# Altium project DriverV2.0.PrjPcb
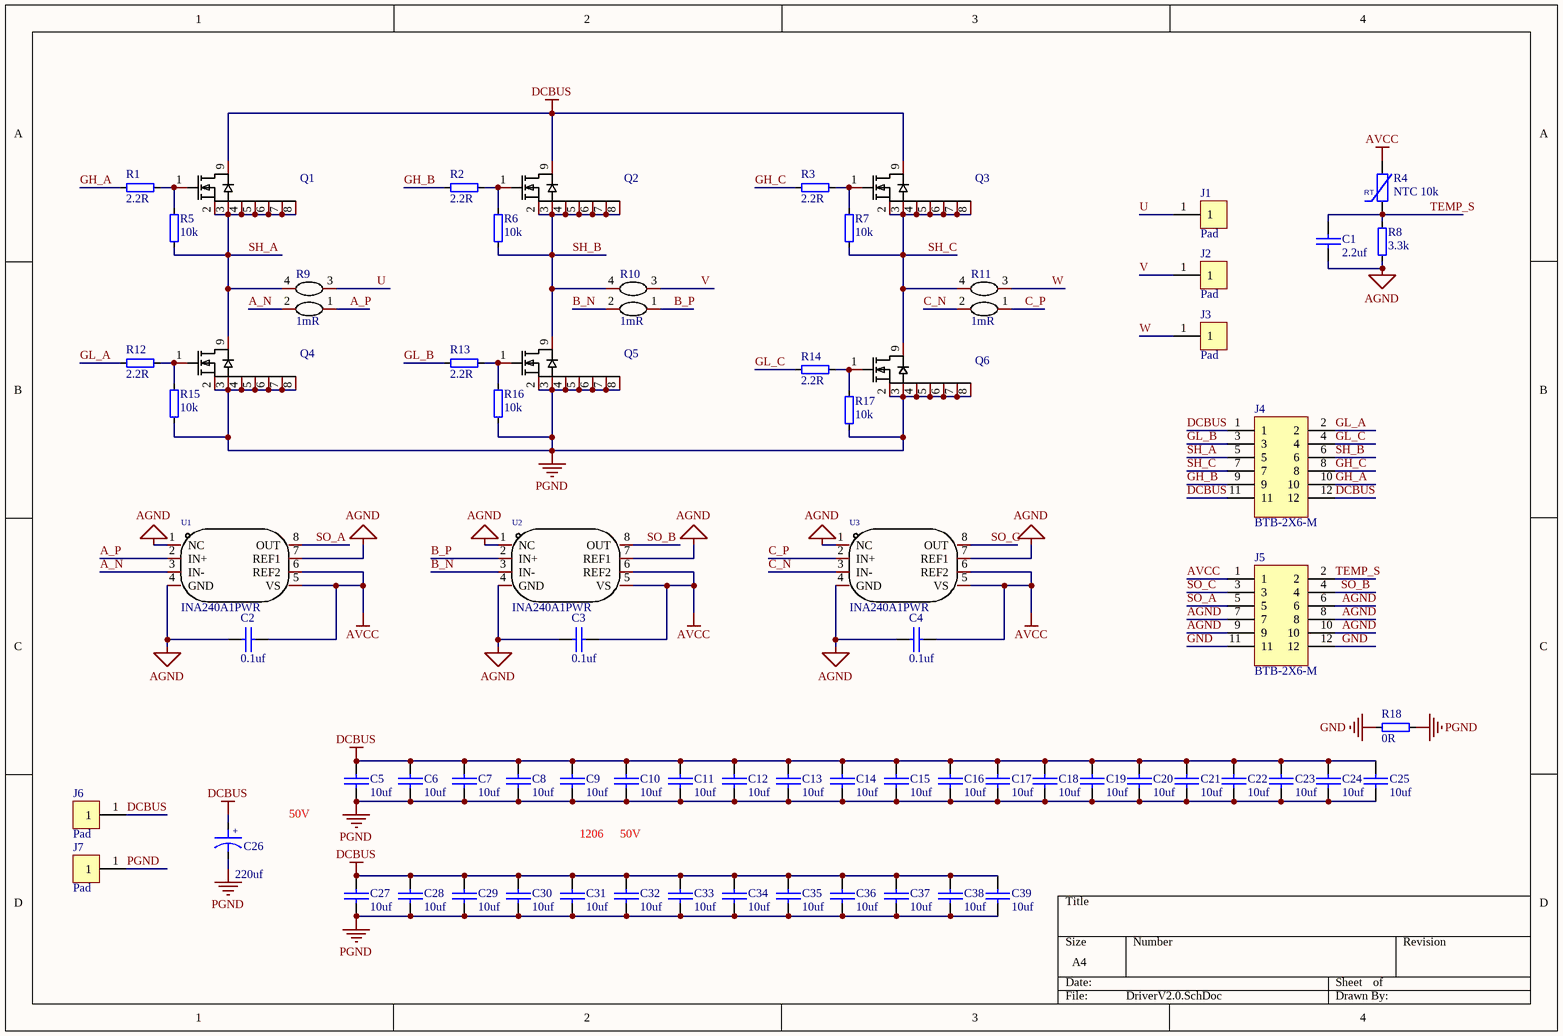
[diagram p0: DriverV2.0.SchDoc]
1 sheet, 73 parts. Net scope: global (net labels, ports and power ports of the same name join across sheets).
Board file: DriverV2.0.PcbDoc

## Sheet DriverV2.0.SchDoc
size A4; SheetNumber: 1; SheetTotal: 1

### Parts
C1  2.2uf  [0603C]
C2  0.1uf  [0603C]
C3  0.1uf  [0603C]
C4  0.1uf  [0603C]
C5  10uf  [1206C]
C6  10uf  [1206C]
C7  10uf  [1206C]
C8  10uf  [1206C]
C9  10uf  [1206C]
C10  10uf  [1206C]
C11  10uf  [1206C]
C12  10uf  [1206C]
C13  10uf  [1206C]
C14  10uf  [1206C]
C15  10uf  [1206C]
C16  10uf  [1206C]
C17  10uf  [1206C]
C18  10uf  [1206C]
C19  10uf  [1206C]
C20  10uf  [1206C]
C21  10uf  [1206C]
C22  10uf  [1206C]
C23  10uf  [1206C]
C24  10uf  [1206C]
C25  10uf  [1206C]
C26  220uf  [ELECTRO10-5-N]
C27  10uf  [1206C]
C28  10uf  [1206C]
C29  10uf  [1206C]
C30  10uf  [1206C]
C31  10uf  [1206C]
C32  10uf  [1206C]
C33  10uf  [1206C]
C34  10uf  [1206C]
C35  10uf  [1206C]
C36  10uf  [1206C]
C37  10uf  [1206C]
C38  10uf  [1206C]
C39  10uf  [1206C]
J1  Pad  [PAD]
J2  Pad  [PAD]
J3  Pad  [PAD]
J4  BTB-2X6-M  [BTB-M-0.8mm-2x6P]
J5  BTB-2X6-M  [BTB-M-0.8mm-2x6P]
J6  Pad  [PAD]
J7  Pad  [PAD]
Q1  HYG006N04LS1TA  [TOLL]  (value not drawn)
Q2  HYG006N04LS1TA  [TOLL]  (value not drawn)
Q3  HYG006N04LS1TA  [TOLL]  (value not drawn)
Q4  HYG006N04LS1TA  [TOLL]  (value not drawn)
Q5  HYG006N04LS1TA  [TOLL]  (value not drawn)
Q6  HYG006N04LS1TA  [TOLL]  (value not drawn)
R1  2.2R  [0603R]
R2  2.2R  [0603R]
R3  2.2R  [0603R]
R4  NTC 10k  [0805R]
R5  10k  [0603R]
R6  10k  [0603R]
R7  10k  [0603R]
R8  3.3k  [0603R]
R9  1mR  [3637R]
R10  1mR  [3637R]
R11  1mR  [3637R]
R12  2.2R  [0603R]
R13  2.2R  [0603R]
R14  2.2R  [0603R]
R15  10k  [0603R]
R16  10k  [0603R]
R17  10k  [0603R]
R18  0R  [0603R]
U1  INA240A1PWR  [TSSOP-8]
U2  INA240A1PWR  [TSSOP-8]
U3  INA240A1PWR  [TSSOP-8]

### Nets
AGND: C1.2 C2.1 C3.1 C4.1 J5.6 J5.7 J5.8 J5.9 J5.10 R8.1 U1.1(NC) U1.4(GND) U1.7(REF1) U2.1(NC) U2.4(GND) U2.7(REF1) U3.1(NC) U3.4(GND) U3.7(REF1)
AVCC: C2.2 C3.2 C4.2 J5.1 R4.2 U1.5(VS) U1.6(REF2) U2.5(VS) U2.6(REF2) U3.5(VS) U3.6(REF2)
DCBUS: C5.1 C6.1 C7.1 C8.1 C9.1 C10.1 C11.1 C12.1 C13.1 C14.1 C15.1 C16.1 C17.1 C18.1 C19.1 C20.1 C21.1 C22.1 C23.1 C24.1 C25.1 C26.1 C27.1 C28.1 C29.1 C30.1 C31.1 C32.1 C33.1 C34.1 C35.1 C36.1 C37.1 C38.1 C39.1 J4.1 J4.11 J4.12 J6.1 Q1.9(D) Q2.9(D) Q3.9(D)
GND: J5.11 J5.12 R18.2
PGND: C5.2 C6.2 C7.2 C8.2 C9.2 C10.2 C11.2 C12.2 C13.2 C14.2 C15.2 C16.2 C17.2 C18.2 C19.2 C20.2 C21.2 C22.2 C23.2 C24.2 C25.2 C26.2 C27.2 C28.2 C29.2 C30.2 C31.2 C32.2 C33.2 C34.2 C35.2 C36.2 C37.2 C38.2 C39.2 J7.1 Q4.2(S) Q4.3(S) Q4.4(S) Q4.5(S) Q4.6(S) Q4.7(S) Q4.8(S) Q5.2(S) Q5.3(S) Q5.4(S) Q5.5(S) Q5.6(S) Q5.7(S) Q5.8(S) Q6.2(S) Q6.3(S) Q6.4(S) Q6.5(S) Q6.6(S) Q6.7(S) Q6.8(S) R15.1 R16.1 R17.1 R18.1
A_N: R9.2 U1.3(IN-)
A_P: R9.1 U1.2(IN+)
B_N: R10.2 U2.3(IN-)
B_P: R10.1 U2.2(IN+)
C_N: R11.2 U3.3(IN-)
C_P: R11.1 U3.2(IN+)
GH_A: J4.10 R1.1
GH_B: J4.9 R2.1
GH_C: J4.8 R3.1
GL_A: J4.2 R12.1
GL_B: J4.3 R13.1
GL_C: J4.4 R14.1
SH_A: J4.5 Q1.2(S) Q1.3(S) Q1.4(S) Q1.5(S) Q1.6(S) Q1.7(S) Q1.8(S) Q4.9(D) R5.1 R9.4
SH_B: J4.6 Q2.2(S) Q2.3(S) Q2.4(S) Q2.5(S) Q2.6(S) Q2.7(S) Q2.8(S) Q5.9(D) R6.1 R10.4
SH_C: J4.7 Q3.2(S) Q3.3(S) Q3.4(S) Q3.5(S) Q3.6(S) Q3.7(S) Q3.8(S) Q6.9(D) R7.1 R11.4
SO_A: J5.5 U1.8(OUT)
SO_B: J5.4 U2.8(OUT)
SO_C: J5.3 U3.8(OUT)
TEMP_S: C1.1 J5.2 R4.1 R8.2
U: J1.1 R9.3
V: J2.1 R10.3
W: J3.1 R11.3
NetQ1_1: Q1.1(G) R1.2 R5.2
NetQ2_1: Q2.1(G) R2.2 R6.2
NetQ3_1: Q3.1(G) R3.2 R7.2
NetQ4_1: Q4.1(G) R12.2 R15.2
NetQ5_1: Q5.1(G) R13.2 R16.2
NetQ6_1: Q6.1(G) R14.2 R17.2

### Notes on the sheet
- 50V
- 1206
- (in symbol CAP+) +

### Library data of the parts
C1-C25 C27-C39 = CAP: 贴片电容
C26 = CAP+: 极性电容
J1-J3 J6 J7 = Pad: 焊盘
J4 J5 = BTB-2X6-M: 0.8间距2x6P公座
Q1-Q6 = HYG006N04LS1TA: N沟道增强型MOS 40V-600A; Manufacturer: HUAYI(华羿微); Add into BOM: yes; Type: N沟道; Drain Source Voltage (Vdss): 40V; Continuous Drain Current (Id): 600A; Power Dissipation (Pd): 428W; Drain Source On Resistance (RDS(on)@Vgs,Id): 0.45mΩ@10V,80A; Gate Threshold Voltage (Vgs(th)@Id): 1.8V@250uA; Total Gate Charge (Qg@Vgs): 230nC@10V; Input Capacitance (Ciss@Vds): 15.4nF@25V; Reverse Transfer Capacitance (Crss@Vds): 115pF@25V; Symbol: HYG006N04LS1TA; Device: HYG006N04LS1TA; LCSC Part Name: N沟道 40V 600A; Supplier Part: C2982928; Manufacturer Part: HYG006N04LS1TA; Supplier Footprint: TOLL; JLCPCB Part Class: 扩展库; Datasheet: https://atta.szlcsc.com/upload/public/pdf/source/20220321/91BDC8248F772C15069ACBA52C025F8E.pdf; Supplier: LCSC; Convert to PCB: yes; Operating Temperature: -55℃~+175℃@(Tj)
R1-R3 R5-R8 R12-R18 = RES: 贴片电阻
R4 = RT: 热敏电阻
R9-R11 = HoLR3637: 四脚采样电阻; Manufacturer: Milliohm(毫欧); Symbol: HOLR3637-5-R010-F; Value: 10mΩ; Add into BOM: yes; Tolerance: ±1%; Power(Watts): 5W; Temperature Coefficient: ±75ppm/℃; Device: HoLR3637-5-R010-F; Supplier: LCSC; Supplier Part: C3024469; Manufacturer Part: HoLR3637-5-R010-F; JLCPCB Part Class: 扩展库; LCSC Part Name: 10mΩ ±1% 5W; Supplier Footprint: 3637; Datasheet: https://atta.szlcsc.com/upload/public/pdf/source/20220606/90C34D3995A0A0E7F0B2BF3C5137C45B.pdf; Convert to PCB: yes; Type: -; Rated Output Voltage: -; Rated Current: -; Mounting Sytle: -
U1-U3 = INA240A1PWR: Manufacturer: TI(德州仪器); Add into BOM: yes; Number of Channels: 1; Supply Current: 1.8mA; Symbol: INA240A1PWR; Device: INA240A1PWR; Supplier: LCSC; Manufacturer Part: INA240A1PWR; Supplier Part: C93965; JLCPCB Part Class: 扩展库; LCSC Part Name: INA240A1PWR; Supplier Footprint: TSSOP-8; Datasheet: https://www.ti.com/cn/lit/gpn/ina240; Convert to PCB: yes; Operating Temperature: -40℃~+125℃; Name: INA240A1PWR